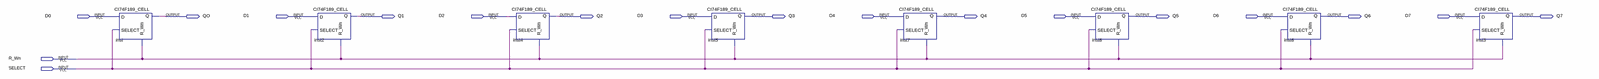
[diagram p0: schematic sheet, whole]
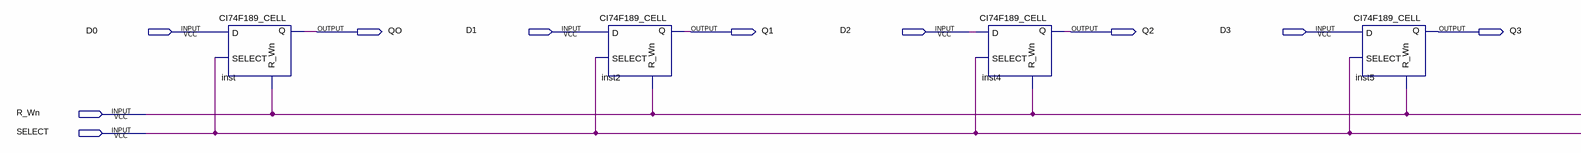
[diagram p1: schematic sheet, left part]
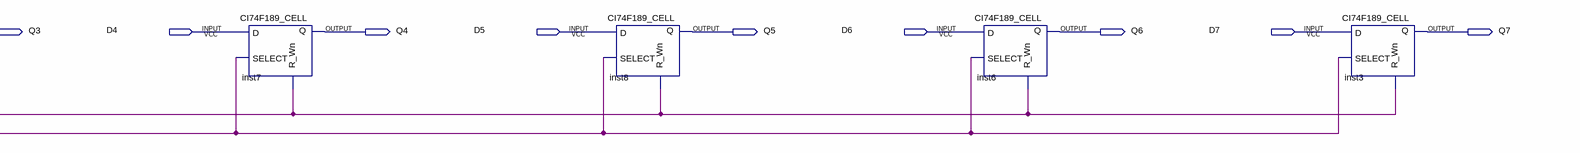
[diagram p2: schematic sheet, right part]
// Quartus schematic CI74F189_BIGGER_CELL.bdf as structural Verilog: 8 symbols, 18 pins
module CI74F189_BIGGER_CELL (
  input  D0,
  input  D1,
  input  D2,
  input  D3,
  input  D4,
  input  D5,
  input  D6,
  input  D7,
  input  R_Wn,
  input  SELECT,
  output QO,
  output Q1,
  output Q2,
  output Q3,
  output Q4,
  output Q5,
  output Q6,
  output Q7
);

  CI74F189_CELL inst (.R_Wn(R_Wn), .SELECT(SELECT), .D(D0), .Q(QO));
  CI74F189_CELL inst2 (.R_Wn(R_Wn), .SELECT(SELECT), .D(D1), .Q(Q1));
  CI74F189_CELL inst4 (.R_Wn(R_Wn), .SELECT(SELECT), .D(D2), .Q(Q2));
  CI74F189_CELL inst5 (.R_Wn(R_Wn), .SELECT(SELECT), .D(D3), .Q(Q3));
  CI74F189_CELL inst7 (.R_Wn(R_Wn), .SELECT(SELECT), .D(D4), .Q(Q4));
  CI74F189_CELL inst8 (.R_Wn(R_Wn), .SELECT(SELECT), .D(D5), .Q(Q5));
  CI74F189_CELL inst6 (.R_Wn(R_Wn), .SELECT(SELECT), .D(D6), .Q(Q6));
  CI74F189_CELL inst3 (.R_Wn(R_Wn), .SELECT(SELECT), .D(D7), .Q(Q7));
endmodule
